# Altium project ESE516_ExampleLayoutProject_.PrjPcb (part 2 of 3)

## Sheet Rotary Encoder.SchDoc: ROTARY ENCODER
size 431 x 279 mm; Date: 02/07/2022; ApprovedBy: RTZ,HYW; CheckedBy: RTZ,HYW; Author: RTZ,HYW; CompanyName: Upenn; DrawnBy: RTZ,HYW; Engineer: RTZ,HYW; Organization: Upenn ESE; Address1: Electrical Engineering; Address2: 200 South 33rd St; Address3: Philadelphia; Address4: PA, 19104; SheetNumber: 6; SheetTotal: 11; ENG_APP_DATE: 02/15/22; DSN_APP_DATE: 02/15/22; CHK_APP_DATE: 02/15/22; DOC_NO_ASSY_DWG: TBD; DOC_NO_FAB_DWG: TBD; PCB_DWG_NO: TBD; Project: SimonSayGame; DESIGN_ITEM: 1.0; CAGE_CODE: TBD; DOC_NO_SCH_DWG: TBD; SCH_SCALE: NA; Time: 13:18
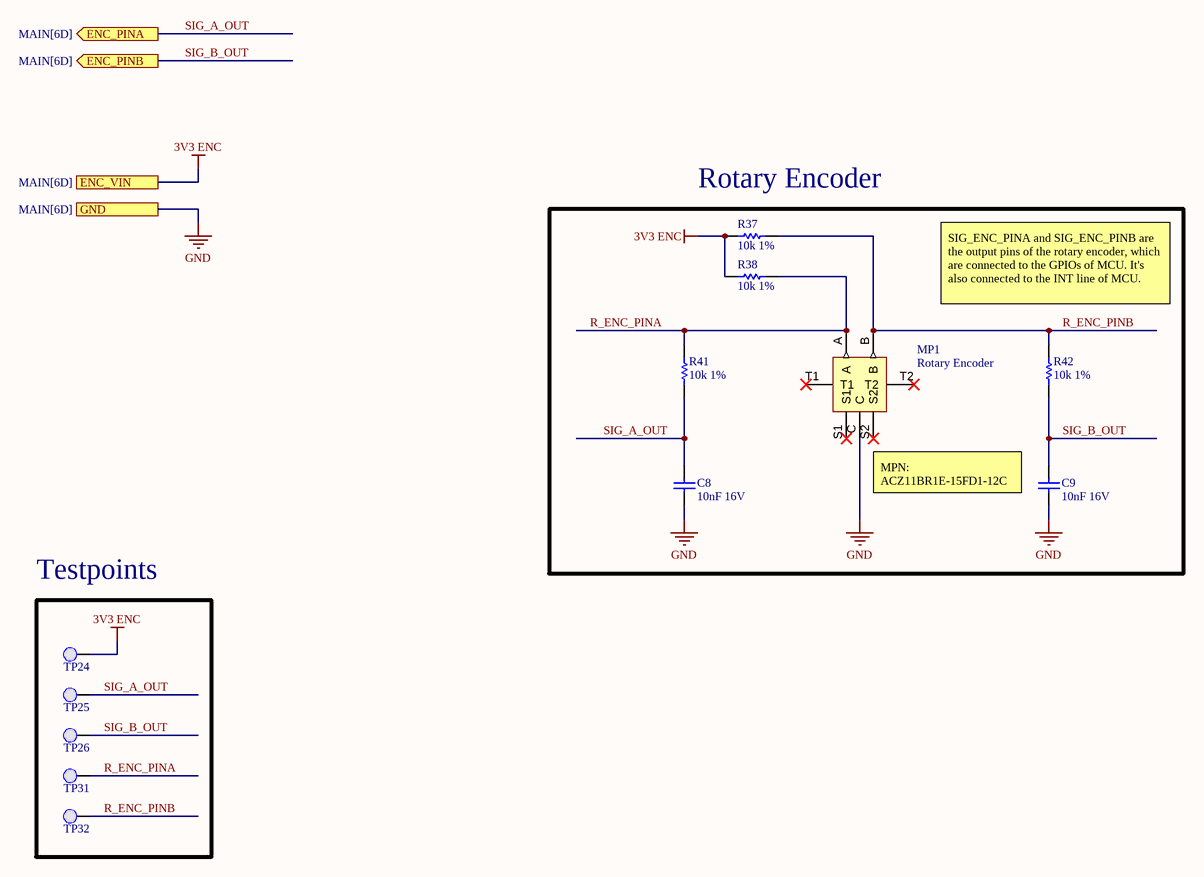
[diagram p5: Rotary Encoder.SchDoc]

### Parts
C8  10nF 16V  [CAPC1608X90]
C9  10nF 16V  [CAPC1608X90]
MP1  Rotary Encoder  [Rotary Encoder]
R37  10k 1%  [RESC1608X55X25ML10T15]
R38  10k 1%  [RESC1608X55X25ML10T15]
R41  10k 1%  [RESC1608X55X25ML10T15]
R42  10k 1%  [RESC1608X55X25ML10T15]
TP24  0.1" Pad  [PCBComponent]  (value not drawn)  (no BOM)
TP25  0.1" Pad  [PCBComponent]  (value not drawn)  (no BOM)
TP26  0.1" Pad  [PCBComponent]  (value not drawn)  (no BOM)
TP31  0.1" Pad  [PCBComponent]  (value not drawn)  (no BOM)
TP32  0.1" Pad  [PCBComponent]  (value not drawn)  (no BOM)

### Blocks framed on the sheet
Rotary Encoder: C8 C9 MP1 R37 R38 R41 R42
Testpoints: TP24-TP26 TP31 TP32

### Ports
ENC_PINA (out, see MAIN[6D]), ENC_PINB (out, see MAIN[6D]), ENC_VIN (see MAIN[6D]), GND (see MAIN[6D])

### Nets
3V3 ENC: R37.2 R38.2 TP24.1(PAD) ; port ENC_VIN
GND: C8.1 C9.1 MP1.C ; port GND
R_ENC_PINA: MP1.A R38.1 R41.2 TP31.1(PAD)  [project net R_ENC_PINA_6]
R_ENC_PINB: MP1.B R37.1 R42.2 TP32.1(PAD)  [project net R_ENC_PINB_6]
SIG_A_OUT: C8.2 R41.1 TP25.1(PAD) ; port ENC_PINA
SIG_B_OUT: C9.2 R42.1 TP26.1(PAD) ; port ENC_PINB

Not connected (* = marked no-connect by the designer): MP1 S1* S2* T1* T2*

### Notes on the sheet
- SIG_ENC_PINA and SIG_ENC_PINB are the output pins of the rotary encoder, which are connected to the GPIOs of MCU. It's also connected to the INT line of MCU.
  The SIG_A_OUT and SIG_B_OUT can be connected to the oscilloscope for test.
- MPN: ACZ11BR1E-15FD1-12C
- DWG. NO.
- REV.
- SHT.
- THIS DOCUMENT AND THE DATA DISCLOSED HEREIN OR HEREWITH IS THE PROPERTY OF ALTIUM LIMITED AND MAY BE FREELY DISTRIBUTED IN WHOLE. NO RIGHTS ARE RESERVED OR EXPRESS OR IMPLIED WARANTEE GIVEN.
- REVISION
- DESCRIPTION
- DATE
- APPROVED
- ENG:
- APPROVALS
- PROJECT
- DSN:
- CHK:
- REFERENCE DOCUMENTS
- PROJECT REVISION:
- TITLE
- DOCUMENT REVISION:
- DESIGN ITEM:
- BOM:
- FAB DWG:
- PCB DWG:
- ASSY DWG:
- SCALE:
- SIZE
- B
- CAGE CODE
- FILE NAME
- DWG NO.
- SHEET
- OF
- REV

### Library data of the parts
C8 C9 = C0603C103K4REC7867: Rotary Enc-Cap Cer 0603 10NF 16V X7R 10%; Manufacturer: KEMET; Supplier 1: Digi-Key; Supplier Part Number 1: 399-C0603C103K4REC7867CT-ND; Manufacturer Part Number: C0603C103K4REC7867; RoHS: No; Category: Ceramic Capacitors; Stock 1: 907; Pricing 1: 1=0.12000, 10=0.08800, 50=0.04820, 100=0.03930, 500=0.02810, 1000=0.02208 (USD)
MP1 = Rotary Encoder: MPN: ACZ11BR1E-15FD1-12C
R37 R38 R41 R42 = CMP-2000-04877-1: AF0603FR-0710KL; Manufacturer: Yageo; Part Number: AF0603FR-0710KL
TP24-TP26 TP31 TP32 = 0.1" Pad-A.4

## Sheet Joystick.SchDoc: JOYSTICK
size 431 x 279 mm; Date: 02/07/2022; ApprovedBy: RTZ,HYW; CheckedBy: RTZ,HYW; Author: RTZ,HYW; CompanyName: Upenn; DrawnBy: RTZ,HYW; Engineer: RTZ,HYW; Organization: Upenn ESE; Address1: Electrical Engineering; Address2: 200 South 33rd St; Address3: Philadelphia; Address4: PA, 19104; SheetNumber: 7; SheetTotal: 11; ENG_APP_DATE: 02/15/22; DSN_APP_DATE: 02/15/22; CHK_APP_DATE: 02/15/22; DOC_NO_ASSY_DWG: TBD; DOC_NO_FAB_DWG: TBD; PCB_DWG_NO: TBD; Project: SimonSayGame; DESIGN_ITEM: 1.0; CAGE_CODE: TBD; DOC_NO_SCH_DWG: TBD; SCH_SCALE: NA; Time: 13:18
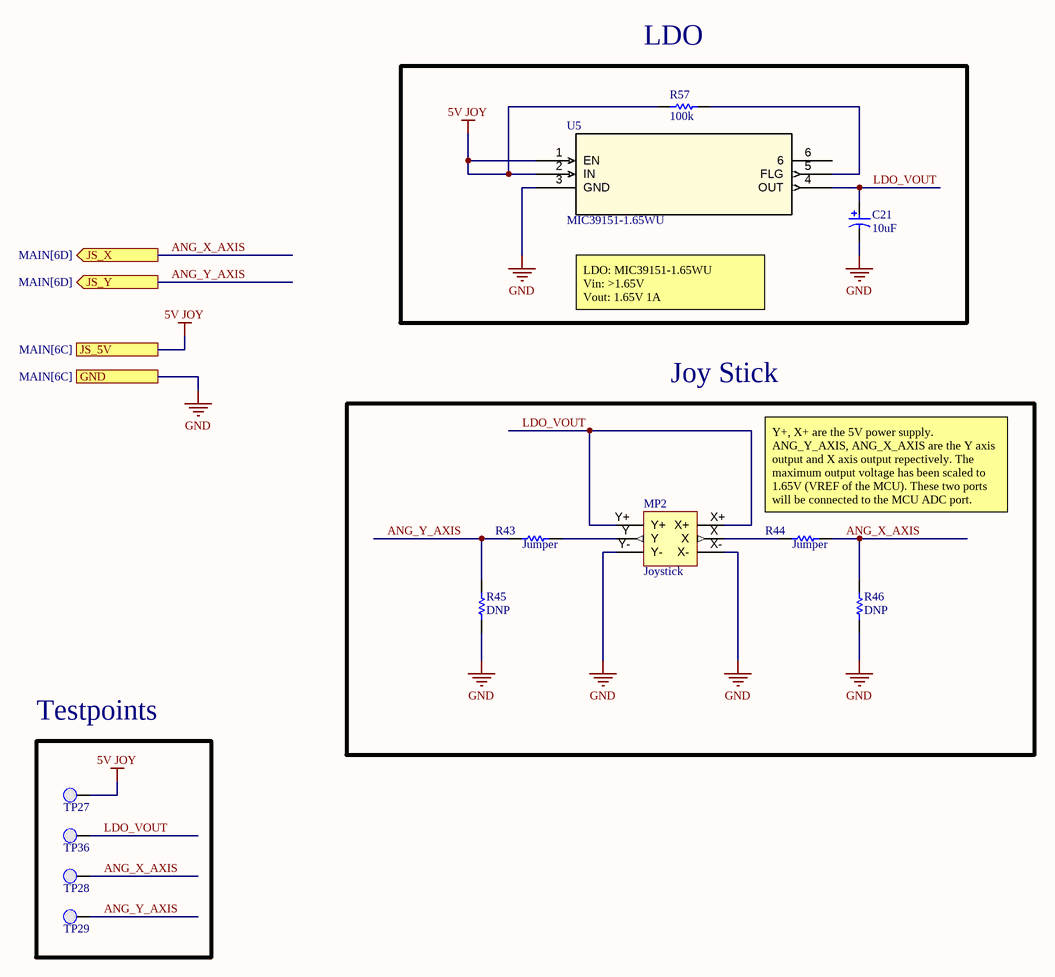
[diagram p6: Joystick.SchDoc]

### Parts
C21  10uF  [TMCHC1C106MTRF]
MP2  Joystick  [Joystick]
R43  Jumper  [RESC0603(1608)_N]
R44  Jumper  [RESC0603(1608)_N]
R45  DNP  [DNP]  (no BOM)
R46  DNP  [DNP]  (no BOM)
R57  100k  [RESC1609X55X30ML10T20]
TP27  0.1" Pad  [PCBComponent]  (value not drawn)  (no BOM)
TP28  0.1" Pad  [PCBComponent]  (value not drawn)  (no BOM)
TP29  0.1" Pad  [PCBComponent]  (value not drawn)  (no BOM)
TP36  0.1" Pad  [PCBComponent]  (value not drawn)  (no BOM)
U5  MIC39151-1.65WU  [TO-263-5_MCL]

### Blocks framed on the sheet
LDO: C21 R57 U5
Joy Stick: MP2 R43-R46
Testpoints: TP27-TP29 TP36

### Ports
GND (see MAIN[6C]), JS_5V (see MAIN[6C]), JS_X (out, see MAIN[6D]), JS_Y (out, see MAIN[6D])

### Nets
5V JOY: R57.1 TP27.1(PAD) U5.1(EN) U5.2(IN) ; port JS_5V  [project net 5V]
GND: C21.2 MP2.X- MP2.Y- R45.1 R46.1 U5.3(GND) ; port GND
ANG_X_AXIS: R44.2 R46.2 TP28.1(PAD) ; port JS_X  [project net ADC_X]
ANG_Y_AXIS: R43.1 R45.2 TP29.1(PAD) ; port JS_Y  [project net ADC_Y]
LDO_VOUT: C21.1 MP2.X+ MP2.Y+ TP36.1(PAD) U5.4(OUT)  [project net LDO_VOUT_7]
NetMP2_X: MP2.X R44.1
NetMP2_Y: MP2.Y R43.2
NetR57_2: R57.2 U5.5(FLG)

Not connected (* = marked no-connect by the designer): U5 6

### Notes on the sheet
- LDO: MIC39151-1.65WU
  Vin: >1.65V
  Vout: 1.65V 1A
- (near R44) Y+, X+ are the 5V power supply.
  ANG_Y_AXIS, ANG_X_AXIS are the Y axis output and X axis output repectively. The maximum output voltage has been scaled to 1.65V (VREF of the MCU). These two ports will be connected to the MCU ADC port.
  Y-, X- are the GND.
- DWG. NO.
- REV.
- SHT.
- THIS DOCUMENT AND THE DATA DISCLOSED HEREIN OR HEREWITH IS THE PROPERTY OF ALTIUM LIMITED AND MAY BE FREELY DISTRIBUTED IN WHOLE. NO RIGHTS ARE RESERVED OR EXPRESS OR IMPLIED WARANTEE GIVEN.
- REVISION
- DESCRIPTION
- DATE
- APPROVED
- ENG:
- APPROVALS
- PROJECT
- DSN:
- CHK:
- REFERENCE DOCUMENTS
- PROJECT REVISION:
- TITLE
- DOCUMENT REVISION:
- DESIGN ITEM:
- BOM:
- FAB DWG:
- PCB DWG:
- ASSY DWG:
- SCALE:
- SIZE
- B
- CAGE CODE
- FILE NAME
- DWG NO.
- SHEET
- OF
- REV

### Library data of the parts
C21 = TMCHC1C106MTRF: 10uF TMCHC1C106MTRF LDO capacitor; Manufacturer Part Number: TMCHC1C106MTRF; Category: Tantalum Capacitors; RoHS Compliant: Yes
R43 R44 = CMP-1012-00001-1: Jumper 0603 (1608 Metric); Case-Metric: 1608; Value: 0.00 Ohm; Power: None; Case-EIA: 0603; Technology: SMT; Tolerance: None
R45 R46 = DNP: Temperature Coefficient: 100ppm/°C; Power Rating: 63mW; Voltage Rating: 50V; Resistance Tolerance: 1%; RoHS: Yes; Case/Package: 0402; Number of Pins: 2; Contact Plating: Tin; Case Code (Metric): 1005; Case Code (Imperial): 0402; Min Operating Temperature: -55°C; Max Operating Temperature: 155°C; Resistor Type: Thick Film; Package Quantity: 10; Number of Terminations: 2; Termination: SMD/SMT; Max Power Dissipation: 63mW; Features: Automotive AEC-Q200; Series: CRCW; Voltage Rating (DC): 50V; Construction: Rectangular; Technology: THICK FILM; Length: 1mm; Width: 0.02inch; Height: 0.35mm; Depth: 0.5mm; Radiation Hardening: No; RoHS Compliant: Yes; Lead Free: Lead Free; REACH SVHC: Unknown; Military Standard: Not
R57 = CMP-2000-03685-1: Manufacturer: Vishay Dale; Part Number: TNPW0603100KBEEA
TP27-TP29 TP36 = 0.1" Pad-A.4
U5 = MIC39151-1.65WU: No Description Available; Mfr_Name: Micrel; Copyright: Copyright (C) 2022 Ultra Librarian. All rights reserved.; Manufacturer_Part_Number: MIC39151-1.65WU; Digi-Key_Part_Number_1: MIC39151-1.65WU-ND; RefDes: RefDes; Type: DEV

## Sheet Boost converter.SchDoc: BOOST CONVERTER
size 431 x 279 mm; Date: 02/07/2022; ApprovedBy: RTZ,HYW; CheckedBy: RTZ,HYW; Author: RTZ,HYW; CompanyName: Upenn; DrawnBy: RTZ,HYW; Engineer: RTZ,HYW; Organization: Upenn ESE; Address1: Electrical Engineering; Address2: 200 South 33rd St; Address3: Philadelphia; Address4: PA, 19104; SheetNumber: 8; SheetTotal: 11; ENG_APP_DATE: 02/15/22; DSN_APP_DATE: 02/15/22; CHK_APP_DATE: 02/15/22; DOC_NO_ASSY_DWG: TBD; DOC_NO_FAB_DWG: TBD; PCB_DWG_NO: TBD; Project: SimonSayGame; DESIGN_ITEM: 1.0; CAGE_CODE: TBD; DOC_NO_SCH_DWG: TBD; SCH_SCALE: NA; Time: 13:18
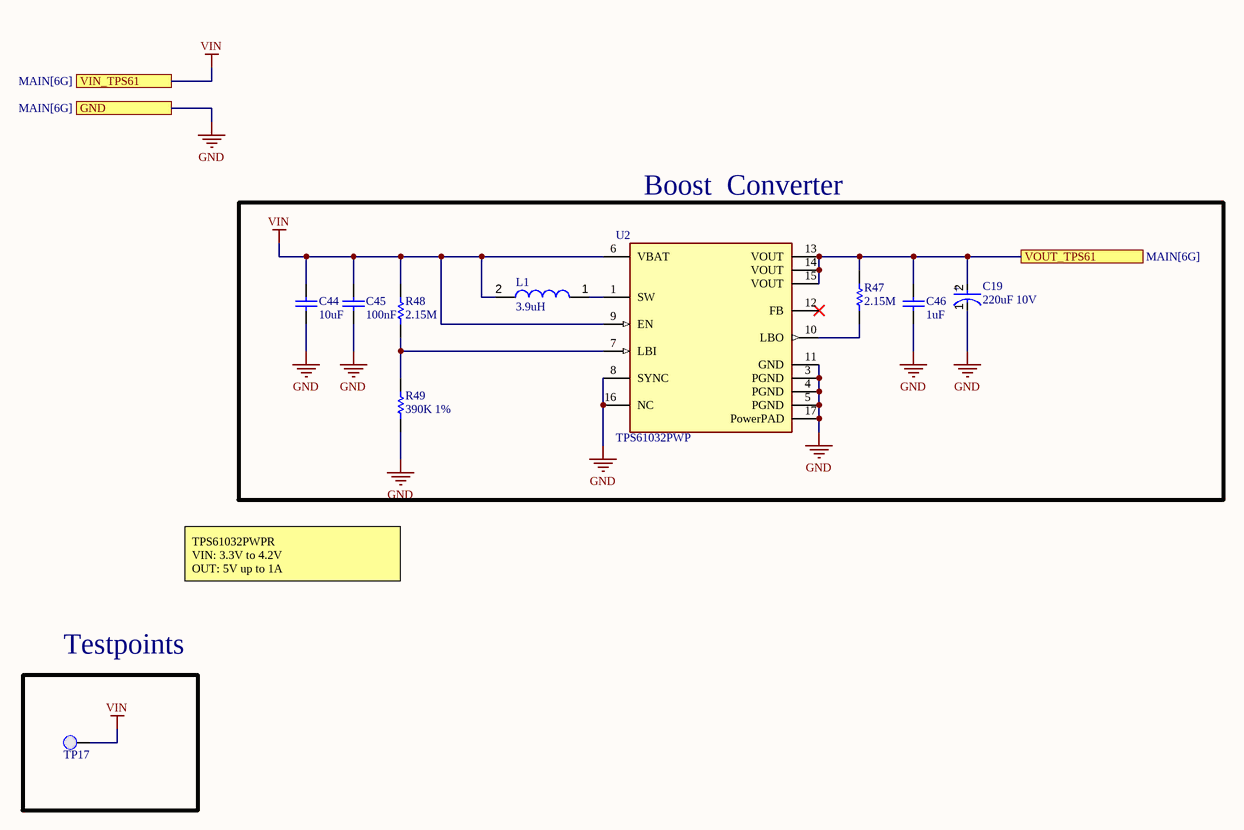
[diagram p7: Boost converter.SchDoc]

### Parts
C19  220uF 10V  [FP-T495D227K010ATE100-MFG]
C44  10uF  [CAPC2012X127N]
C45  100nF  [CAPC1005X55X25LL05T10]
C46  1uF  [CAPC1608X90]
L1  3.9uH  [7843330390]
R47  2.15M  [RESC1005X40X25ML05T05]
R48  2.15M  [RESC1005X40X25ML05T05]
R49  390K 1%  [RESC0603(1608)_M]
TP17  0.1" Pad  [PCBComponent]  (value not drawn)  (no BOM)
U2  TPS61032PWP  [FP-PWP0016C-MFG]

### Blocks framed on the sheet
Boost  Converter: C19 C44-C46 L1 R47-R49 U2
Testpoints: TP17

### Ports
GND (see MAIN[6G]), VIN_TPS61 (see MAIN[6G]), VOUT_TPS61 (see MAIN[6G])

### Nets
GND: C19.1(C) C44.1 C45.1 C46.1 R49.1 U2.3(PGND) U2.4(PGND) U2.5(PGND) U2.8(SYNC) U2.11(GND) U2.16(NC) U2.17(PowerPAD) ; port GND
VIN: C44.2 C45.2 L1.2 R48.2 TP17.1(PAD) U2.6(VBAT) U2.9(EN) ; port VIN_TPS61  [project net VOUT]
VOUT_TPS61: C19.2(A) C46.2 R47.2 U2.13(VOUT) U2.14(VOUT) U2.15(VOUT) ; port VOUT_TPS61
NetL1_1: L1.1 U2.1(SW)
NetR47_1: R47.1 U2.10(LBO)
NetR48_1: R48.1 R49.2 U2.7(LBI)

Not connected (* = marked no-connect by the designer): U2 12(FB)*

### Notes on the sheet
- TPS61032PWPR
  VIN: 3.3V to 4.2V
  OUT: 5V up to 1A
- DWG. NO.
- REV.
- SHT.
- THIS DOCUMENT AND THE DATA DISCLOSED HEREIN OR HEREWITH IS THE PROPERTY OF ALTIUM LIMITED AND MAY BE FREELY DISTRIBUTED IN WHOLE. NO RIGHTS ARE RESERVED OR EXPRESS OR IMPLIED WARANTEE GIVEN.
- REVISION
- DESCRIPTION
- DATE
- APPROVED
- ENG:
- APPROVALS
- PROJECT
- DSN:
- CHK:
- REFERENCE DOCUMENTS
- PROJECT REVISION:
- TITLE
- DOCUMENT REVISION:
- DESIGN ITEM:
- BOM:
- FAB DWG:
- PCB DWG:
- ASSY DWG:
- SCALE:
- SIZE
- B
- CAGE CODE
- FILE NAME
- DWG NO.
- SHEET
- OF
- REV
- (in symbol CMP-03017-000025-1) +

### Library data of the parts
C19 = CMP-03017-000025-1: CAP TANT 220UF 10% 10V 2917, T495D227K010ATE100; Life (Hours): 2000Hour; Dielectric Material: Tantalum; Ripple Current: 1.225A; Dissipation Factor: 8%; ESR (Equivalent Series Resistance): 100mR; Leakage Current: 22uA; Polarity: Polar; Max Operating Temperature: 125°C; Features: General Purpose; Voltage Rating: 10V; Depth: 4.3mm; Case Code (Imperial): 2917; Length: 7.3mm; Package Quantity: 1; Mount: Surface Mount; Min Operating Temperature: -55°C; Termination: SMD/SMT; Voltage Rating (DC): 10V; Height: 2.8mm; Construction: Flat; Case Code (Metric): 7343; Radiation Hardening: No; Number of Pins: 2; Series: T495; Tolerance: 10%; Capacitance: 220uF; Case/Package: 2917; Lead Pitch: 3.8mm; RoHS Compliant: Yes; Width: 0.169inch; Packaging: Tape and Reel; Voltage: 10V; Height - Seated (Max): 0.122inch; REACH SVHC: No SVHC
C44 = CMP-06035-062410-1: Boost Cin, Buck Cin-Cap Ceramic 10uF 16V X7R 20% SMD 0805 125°C Blister T/R; Manufacturer: Murata; Manufacturer Part Number: GRJ155R60J106ME11D; Voltage Rating: 6.3V; Length: 0.039inch; Width: 0.02inch; Capacitance: 10uF; Max Operating Temperature: 85°C; Features: Soft Termination; Case Code (Metric): 1005; Tolerance: 20%; Min Operating Temperature: -55°C; Thickness: 0.028inch; Mount: Surface Mount; Packaging: Cut Tape; Case/Package: 0402; Case Code (Imperial): 0402; RoHS Compliant: Yes; Supplier 1: Digi-Key; Supplier Part Number 1: 490-13211-2-ND; RoHS: Yes; Category: Ceramic Capacitors; Stock 1: 1752680; Pricing 1: 10000=0.03490, 20000=0.03307 (USD); ComponentLink1URL: http://psearch.en.murata.com/capacitor/product/GRJ155R60J106ME11%23.pdf?src-supplier=Digi-Key; ComponentLink1Description: http://psearch.en.murata.com/capacitor/product/GRJ155R60J106ME11%23.pdf?src-supplier=Digi-Key; Supplier 2: Digi-Key; Supplier Part Number 2: 311-1338-2-ND; Stock 2: 27298742; Pricing 2: 10000=0.00554, 20000=0.00528 (USD); Number of Pins: 2; Dielectric: X7R; Voltage Rating (DC): 16V; Package Quantity: 1; Termination: SMD/SMT; Resistor Type: Ceramic; Voltage: 16V; Series: CC; Height: 0.5mm; Depth: 0.5mm; Radiation Hardening: No; REACH SVHC: No SVHC; Lead Free: Lead Free; Halogen Free: Halogen Free; ComponentLink2URL: https://datasheet.ciiva.com/11788/0900766b80ce67ed-11788364.pdf?src-supplier=RSComponents; ComponentLink2Description: https://datasheet.ciiva.com/11788/0900766b80ce67ed-11788364.pdf?src-supplier=RSComponents; ComponentLink3URL: https://datasheet.ciiva.com/7978/1489800-7978111.pdf?src-supplier=Element14; ComponentLink3Description: https://datasheet.ciiva.com/7978/1489800-7978111.pdf?src-supplier=Element14; ComponentLink4URL: https://datasheet.ciiva.com/28450/1489800-28450335.pdf?src-supplier=Element14; ComponentLink4Description: https://datasheet.ciiva.com/28450/1489800-28450335.pdf?src-supplier=Element14; ComponentLink5URL: https://datasheet.ciiva.com/161/mlccorderingcode-161545.pdf?src-supplier=Digi-Key; ComponentLink5Description: https://datasheet.ciiva.com/161/mlccorderingcode-161545.pdf?src-supplier=Digi-Key; ComponentLink6URL: https://datasheet.ciiva.com/161/mlccorderingcode-161544.pdf?src-supplier=Digi-Key; ComponentLink6Description: https://datasheet.ciiva.com/161/mlccorderingcode-161544.pdf?src-supplier=Digi-Key; ComponentLink7URL: https://datasheet.ciiva.com/161/mlccorderingcode-161546.pdf?src-supplier=Digi-Key; ComponentLink7Description: https://datasheet.ciiva.com/161/mlccorderingcode-161546.pdf?src-supplier=Digi-Key; ComponentLink8URL: https://datasheet.ciiva.com/13395/upy-gphc-x7r-6-3v-to-50v-8-13395676.pdf?src-supplier=Mouser; ComponentLink8Description: https://datasheet.ciiva.com/13395/upy-gphc-x7r-6-3v-to-50v-8-13395676.pdf?src-supplier=Mouser; ComponentLink9URL: https://datasheet.ciiva.com/11587/upy-gphc-x7r-6-3v-to-50v-8-11587305.pdf?src-supplier=Avnet; ComponentLink9Description: https://datasheet.ciiva.com/11587/upy-gphc-x7r-6-3v-to-50v-8-11587305.pdf?src-supplier=Avnet; ComponentLink10URL: https://datasheet.ciiva.com/8033/1734573-8033663.pdf?src-supplier=Element14; ComponentLink10Description: https://datasheet.ciiva.com/8033/1734573-8033663.pdf?src-supplier=Element14; ComponentLink11URL: https://datasheet.ciiva.com/8033/1734573-8033661.pdf?src-supplier=Element14; ComponentLink11Description: https://datasheet.ciiva.com/8033/1734573-8033661.pdf?src-supplier=Element14; ComponentLink12URL: https://datasheet.ciiva.com/16625/upy-gphc-x7r-6-3v-to-50v-8-16625511.pdf?src-supplier=Avnet+Europe; ComponentLink12Description: https://datasheet.ciiva.com/16625/upy-gphc-x7r-6-3v-to-50v-8-16625511.pdf?src-supplier=Avnet+Europe; Supplier 3: Digi-Key; Supplier Part Number 3: 311-3508-1-ND; Stock 3: 2481; Pricing 3: 1=0.64000, 10=0.45400, 50=0.34360, 100=0.29920, 500=0.22164, 1000=0.18840 (USD); ComponentLink13URL: http://www.yageo.com/documents/recent/UPY-GPHC_X7R_6.3V-to-50V_18.pdf?src-supplier=Digi-Key; ComponentLink13Description: http://www.yageo.com/documents/recent/UPY-GPHC_X7R_6.3V-to-50V_18.pdf?src-supplier=Digi-Key; ComponentLink14URL: https://datasheet.octopart.com/CC0805MKX7R7BB106-Yageo-datasheet-10883670.pdf; ComponentLink14Description: https://datasheet.octopart.com/CC0805MKX7R7BB106-Yageo-datasheet-10883670.pdf; ComponentLink15URL: https://datasheet.octopart.com/Surface-Mount-Ceramic-Multilayer-Capacitors%3B-General-Purpose-%26-High-Capacitance-Class-2%2C-X7R-Yageo-datasheet-family-114.pdf; ComponentLink15Description: https://datasheet.octopart.com/Surface-Mount-Ceramic-Multilayer-Capacitors%3B-General-Purpose-%26-High-Capacitance-Class-2%2C-X7R-Yageo-datasheet-family-114.pdf; ComponentLink16URL: https://datasheet.octopart.com/CC0805MKX7R7BB106-Yageo-datasheet-147453679.pdf?src-supplier=Future+Electronics; ComponentLink16Description: https://datasheet.octopart.com/CC0805MKX7R7BB106-Yageo-datasheet-147453679.pdf?src-supplier=Future+Electronics
C45 = CMP-2000-06331-1: Boost Cinx, Cap 100NF 16V 0402 SMD 10% X7R; Manufacturer: Murata; Manufacturer Part Number: GRM155R71A104KA01D; Rated Voltage: 10V; Capacitance: 100000pF; Dissipation Factor: 0.035%; Manufacturer URL: http://www.murata.com/; Datasheet Version: 02/2016; Datasheet URL: http://search.murata.co.jp/Ceramy/image/img/A01X/G101/ENG/GRM155R71A104KA01-01.pdf; Dielectric: X7R; Package Reference: 0402; Tolerance (%): ±10%; Package Description: 2-Pin Surface Mount Device, Body 1 x 0.5 mm; Mounting Technology: SurfaceMount; Case Size/Dimension: 0402; Supplier 1: Digi-Key; Supplier Part Number 1: 490-6321-1-ND; RoHS: Yes; Category: Ceramic Capacitors; Stock 1: 5059; Pricing 1: 1=0.10000, 10=0.02300, 50=0.01260, 100=0.01030, 500=0.00736, 1000=0.00578, 2500=0.00525, 5000=0.00483 (USD); Mount: Surface Mount; Case/Package: 0402; Number of Pins: 2; Case Code (Metric): 1005; Case Code (Imperial): 0402; Min Operating Temperature: -55°C; Max Operating Temperature: 125°C; Tolerance: 10%; Package Quantity: 1; Voltage Rating: 10V; Packaging: Tape and Reel; Voltage Rating (DC): 10V; Termination: SMD/SMT; Voltage: 10V; Series: GRM; Construction: Flat; Length: 1mm; Width: 0.02inch; Height: 0.5mm; Thickness: 0.022inch; Depth: 0.5mm; Size: 0.5mm; Radiation Hardening: No; REACH SVHC: No SVHC; Lead Free: Lead Free; RoHS Compliant: Yes; ComponentLink1URL: https://datasheet.ciiva.com/6271/product-6271137.pdf?src-supplier=Digi-Key; ComponentLink1Description: https://datasheet.ciiva.com/6271/product-6271137.pdf?src-supplier=Digi-Key; ComponentLink2URL: https://datasheet.ciiva.com/19475/1856345-19475961.pdf?src-supplier=Jameco; ComponentLink2Description: https://datasheet.ciiva.com/19475/1856345-19475961.pdf?src-supplier=Jameco; ComponentLink3URL: https://datasheet.ciiva.com/11789/0900766b80ef921d-11789061.pdf?src-supplier=RSComponents; ComponentLink3Description: https://datasheet.ciiva.com/11789/0900766b80ef921d-11789061.pdf?src-supplier=RSComponents; ComponentLink4URL: https://datasheet.ciiva.com/7937/1747441-7937613.pdf?src-supplier=Element14; ComponentLink4Description: https://datasheet.ciiva.com/7937/1747441-7937613.pdf?src-supplier=Element14; ComponentLink5URL: https://datasheet.ciiva.com/18184/getdatasheetpartid-130330-18184636.pdf?src-supplier=Verical; ComponentLink5Description: https://datasheet.ciiva.com/18184/getdatasheetpartid-130330-18184636.pdf?src-supplier=Verical; ComponentLink6URL: https://datasheet.ciiva.com/6271/partnumbering-e-01-6271135.pdf?src-supplier=Digi-Key; ComponentLink6Description: https://datasheet.ciiva.com/6271/partnumbering-e-01-6271135.pdf?src-supplier=Digi-Key; ComponentLink7URL: https://datasheet.ciiva.com/16199/c02e-16199258.pdf?src-supplier=Future+Electronics; ComponentLink7Description: https://datasheet.ciiva.com/16199/c02e-16199258.pdf?src-supplier=Future+Electronics; Supplier 2: Digi-Key; Supplier Part Number 2: 311-1338-2-ND; Stock 2: 27298742; Pricing 2: 10000=0.00554, 20000=0.00528 (USD); Resistor Type: Ceramic; Halogen Free: Halogen Free; ComponentLink8URL: https://datasheet.ciiva.com/11788/0900766b80ce67ed-11788364.pdf?src-supplier=RSComponents; ComponentLink8Description: https://datasheet.ciiva.com/11788/0900766b80ce67ed-11788364.pdf?src-supplier=RSComponents; ComponentLink9URL: https://datasheet.ciiva.com/7978/1489800-7978111.pdf?src-supplier=Element14; ComponentLink9Description: https://datasheet.ciiva.com/7978/1489800-7978111.pdf?src-supplier=Element14; ComponentLink10URL: https://datasheet.ciiva.com/28450/1489800-28450335.pdf?src-supplier=Element14; ComponentLink10Description: https://datasheet.ciiva.com/28450/1489800-28450335.pdf?src-supplier=Element14; ComponentLink11URL: https://datasheet.ciiva.com/161/mlccorderingcode-161545.pdf?src-supplier=Digi-Key; ComponentLink11Description: https://datasheet.ciiva.com/161/mlccorderingcode-161545.pdf?src-supplier=Digi-Key; ComponentLink12URL: https://datasheet.ciiva.com/161/mlccorderingcode-161544.pdf?src-supplier=Digi-Key; ComponentLink12Description: https://datasheet.ciiva.com/161/mlccorderingcode-161544.pdf?src-supplier=Digi-Key; ComponentLink13URL: https://datasheet.ciiva.com/161/mlccorderingcode-161546.pdf?src-supplier=Digi-Key; ComponentLink13Description: https://datasheet.ciiva.com/161/mlccorderingcode-161546.pdf?src-supplier=Digi-Key; ComponentLink14URL: https://datasheet.ciiva.com/13395/upy-gphc-x7r-6-3v-to-50v-8-13395676.pdf?src-supplier=Mouser; ComponentLink14Description: https://datasheet.ciiva.com/13395/upy-gphc-x7r-6-3v-to-50v-8-13395676.pdf?src-supplier=Mouser; ComponentLink15URL: https://datasheet.ciiva.com/11587/upy-gphc-x7r-6-3v-to-50v-8-11587305.pdf?src-supplier=Avnet; ComponentLink15Description: https://datasheet.ciiva.com/11587/upy-gphc-x7r-6-3v-to-50v-8-11587305.pdf?src-supplier=Avnet; ComponentLink16URL: https://datasheet.ciiva.com/8033/1734573-8033663.pdf?src-supplier=Element14; ComponentLink16Description: https://datasheet.ciiva.com/8033/1734573-8033663.pdf?src-supplier=Element14; ComponentLink17URL: https://datasheet.ciiva.com/8033/1734573-8033661.pdf?src-supplier=Element14; ComponentLink17Description: https://datasheet.ciiva.com/8033/1734573-8033661.pdf?src-supplier=Element14; ComponentLink18URL: https://datasheet.ciiva.com/16625/upy-gphc-x7r-6-3v-to-50v-8-16625511.pdf?src-supplier=Avnet+Europe; ComponentLink18Description: https://datasheet.ciiva.com/16625/upy-gphc-x7r-6-3v-to-50v-8-16625511.pdf?src-supplier=Avnet+Europe
C46 = C0603C105K8PACTU: Boost Coutx, Cap Ceramic 1uF 16V X7R 5% SMD 0603 125°C Paper T/R; Manufacturer: KEMET; MF: {'manufacturer': u'KEMET'}; Tolerance: 10%; Dielectric: X5R; Voltage: 10V; Value: *; Package: None; MP: C0603C105K8PACTU; Price: None; Availability: Unavailable; Supplier 1: Digi-Key; Supplier Part Number 1: 399-C0603C105K8PAC7867TR-ND; Manufacturer Part Number: C0603C105K8PACTU; RoHS: Yes; Category: Ceramic Capacitors; Stock 1: 359436; Pricing 1: 4000=0.01113, 8000=0.01016 (USD); Mount: Surface Mount; Case/Package: 0603; Number of Pins: 2; Dielectric Material: Ceramic; Case Code (Imperial): 0603; Case Code (Metric): 1608; Weight: 7.1E-05oz; Min Operating Temperature: -55°C; Max Operating Temperature: 85°C; Capacitance: 1uF; Packaging: Tape and Reel; Termination: SMD/SMT; Voltage Rating (DC): 10V; Package Quantity: 1; Voltage Rating: 10V; Series: C; Construction: Flat; Length: 1.6mm; Width: 0.031inch; Height: 0.8mm; Depth: 0.8mm; Thickness: 0.035inch; Radiation Hardening: No; Lead Free: Lead Free; REACH SVHC: No SVHC; RoHS Compliant: Yes; ComponentLink1URL: https://datasheet.ciiva.com/11787/0900766b8116eb59-11787747.pdf?src-supplier=RSComponents; ComponentLink1Description: https://datasheet.ciiva.com/11787/0900766b8116eb59-11787747.pdf?src-supplier=RSComponents; ComponentLink2URL: https://datasheet.ciiva.com/6074/40889-6074647.pdf?src-supplier=Farnell; ComponentLink2Description: https://datasheet.ciiva.com/6074/40889-6074647.pdf?src-supplier=Farnell; ComponentLink3URL: https://datasheet.ciiva.com/26847/getdatasheetpartid-385480-26847548.pdf?src-supplier=Verical; ComponentLink3Description: https://datasheet.ciiva.com/26847/getdatasheetpartid-385480-26847548.pdf?src-supplier=Verical; ComponentLink4URL: https://datasheet.ciiva.com/7823/40889-7823998.pdf?src-supplier=Element14; ComponentLink4Description: https://datasheet.ciiva.com/7823/40889-7823998.pdf?src-supplier=Element14; ComponentLink5URL: https://datasheet.ciiva.com/7823/1929483-7823999.pdf?src-supplier=Element14; ComponentLink5Description: https://datasheet.ciiva.com/7823/1929483-7823999.pdf?src-supplier=Element14; ComponentLink6URL: https://datasheet.ciiva.com/28645/1831760-28645655.pdf?src-supplier=Element14; ComponentLink6Description: https://datasheet.ciiva.com/28645/1831760-28645655.pdf?src-supplier=Element14; Supplier 2: Digi-Key; Supplier Part Number 2: 13-CC0603JRX7R7BB102CT-ND; Stock 2: 33465; Pricing 2: 1=0.10000, 10=0.07000, 50=0.03800, 100=0.03100, 500=0.02218, 1000=0.01742 (USD); Halogen Free: Halogen Free; ComponentLink7URL: https://datasheet.ciiva.com/11494/upy-gphc-x7r-6-3v-to-50v-8-11494730.pdf?src-supplier=Avnet; ComponentLink7Description: https://datasheet.ciiva.com/11494/upy-gphc-x7r-6-3v-to-50v-8-11494730.pdf?src-supplier=Avnet; Supplier 3: Digi-Key; Supplier Part Number 3: 311-3485-1-ND; Stock 3: 56081; Pricing 3: 1=0.26000, 10=0.17800, 50=0.10680, 100=0.09020, 500=0.06174, 1000=0.05462 (USD); ComponentLink8URL: http://www.yageo.com/documents/recent/UPY-GPHC_X7R_6.3V-to-50V_18.pdf?src-supplier=Digi-Key; ComponentLink8Description: http://www.yageo.com/documents/recent/UPY-GPHC_X7R_6.3V-to-50V_18.pdf?src-supplier=Digi-Key
L1 = 7843330390: Boost L1-Inductor, Aec-Q200, 3.9Uh, Shld, 11.2A Rohs Compliant: Yes; Manufacturer: Wurth Electronics; Supplier 1: Digi-Key; Supplier Part Number 1: 732-11759-1-ND; Manufacturer Part Number: 7843330390; RoHS: Yes; Stock 1: 334; Pricing 1: 1=2.77000, 10=2.71300, 50=2.50400, 100=2.39900 (USD); RoHS Compliant: No
R47 R48 = CMP-2002-00322-1: Boost Rlbt-Res Thick Film 0402 2.15M Ohm 1% 1/16W ±100ppm/°C Molded SMD SMD Paper T/R; Manufacturer: Vishay Dale; Part Number: CRCW04022M15FKED; Resistance: 2.15MR; Max Power Dissipation: 63mW; Voltage Rating: 50V; Supplier 1: Digi-Key; Supplier Part Number 1: 541-2.15MLCT-ND; Manufacturer Part Number: CRCW04022M15FKED; RoHS: Yes; Category: Chip SMD Resistors; Stock 1: 790; Pricing 1: 1=0.10000, 10=0.03800, 100=0.01530, 1000=0.00686, 2500=0.00595, 5000=0.00492 (USD); Case/Package: 0402; Number of Pins: 2; Weight: 2.3E-05oz; Case Code (Metric): 1005; Case Code (Imperial): 0402; Contact Plating: Tin; Min Operating Temperature: -55°C; Max Operating Temperature: 155°C; Packaging: Tape and Reel; Tolerance: 1%; Resistor Type: Thick Film; Number of Terminations: 2; Temperature Coefficient: 100ppm/°C; Power Rating: 63mW; Package Quantity: 10000; Termination: SMD/SMT; Voltage Rating (DC): 50V; Features: Automotive AEC-Q200; Series: CRCW; Construction: Rectangular; Resistance Tolerance: 1%; Length: 1mm; Width: 0.02inch; Height: 0.016inch; Depth: 0.5mm; Radiation Hardening: No; RoHS Compliant: Yes; REACH SVHC: Unknown; Military Standard: Not; Lead Free: Lead Free; ComponentLink1URL: https://datasheet.ciiva.com/9091/dcrcwe3-9091823.pdf?src-supplier=Avnet; ComponentLink1Description: https://datasheet.ciiva.com/9091/dcrcwe3-9091823.pdf?src-supplier=Avnet; ComponentLink2URL: https://datasheet.ciiva.com/2464/dcrcwe3-2464648.pdf?src-supplier=Digi-Key; ComponentLink2Description: https://datasheet.ciiva.com/2464/dcrcwe3-2464648.pdf?src-supplier=Digi-Key; ComponentLink3URL: https://datasheet.ciiva.com/2464/dcrcwe3-2464649.pdf?src-supplier=Digi-Key; ComponentLink3Description: https://datasheet.ciiva.com/2464/dcrcwe3-2464649.pdf?src-supplier=Digi-Key; ComponentLink4URL: https://datasheet.ciiva.com/2464/dcrcwe3-2464650.pdf?src-supplier=Digi-Key; ComponentLink4Description: https://datasheet.ciiva.com/2464/dcrcwe3-2464650.pdf?src-supplier=Digi-Key; ComponentLink5URL: https://datasheet.ciiva.com/5543/dcrcwe3-109170-5543499.pdf?src-supplier=Mouser; ComponentLink5Description: https://datasheet.ciiva.com/5543/dcrcwe3-109170-5543499.pdf?src-supplier=Mouser; ComponentLink6URL: https://datasheet.ciiva.com/22708/1697337-22708317.pdf?src-supplier=Element14; ComponentLink6Description: https://datasheet.ciiva.com/22708/1697337-22708317.pdf?src-supplier=Element14; ComponentLink7URL: https://datasheet.ciiva.com/7801/1697337-7801003.pdf?src-supplier=Element14; ComponentLink7Description: https://datasheet.ciiva.com/7801/1697337-7801003.pdf?src-supplier=Element14; ComponentLink8URL: https://datasheet.ciiva.com/7801/1697337-7801004.pdf?src-supplier=Element14; ComponentLink8Description: https://datasheet.ciiva.com/7801/1697337-7801004.pdf?src-supplier=Element14
R49 = CMP-1012-00802-1: Boost Rlbb-Res Thick Film 0603 390K Ohm 1% 0.1W(1/10W) ±100ppm/C Pad SMD T/R; Manufacturer: Yageo; Manufacturer Part Number: RC0603FR-07390KL; Case-EIA: 0603; Case-Metric: 1608; Value: 390000.00 Ohm; Resistance: 390kR; Power Rating: 100mW; Voltage Rating: 50V; Temperature Coefficient: 100ppm/°C; Working Voltage: 75V; Power: 0.1 W; Technology: SMT; Tolerance: 1 %; Supplier 1: Digi-Key; Supplier Part Number 1: 311-390KHRCT-ND; RoHS: Yes; Category: Chip SMD Resistors; Stock 1: 129633; Pricing 1: 1=0.10000, 10=0.02400, 100=0.00970, 1000=0.00436, 2500=0.00378 (USD); Case/Package: 0603; Number of Pins: 2; Case Code (Imperial): 0603; Case Code (Metric): 1608; Min Operating Temperature: -55°C; Max Operating Temperature: 155°C; Packaging: Tape and Reel; Voltage Rating (DC): 50V; Package Quantity: 1; Termination: SMD/SMT; Resistor Type: Thick Film; Number of Terminations: 2; Max Power Dissipation: 100mW; Features: Moisture Resistant; Series: RC; Resistance Tolerance: 1%; Construction: Rectangular; Length: 1.6mm; Width: 0.031inch; Height: 0.022inch; Depth: 0.8mm; REACH SVHC: Unknown; Military Standard: Not; Lead Free: Lead Free; RoHS Compliant: Yes; ComponentLink1URL: https://datasheet.ciiva.com/5557/rc0603-5557952.pdf?src-supplier=Mouser; ComponentLink1Description: https://datasheet.ciiva.com/5557/rc0603-5557952.pdf?src-supplier=Mouser; ComponentLink2URL: https://datasheet.ciiva.com/11819/0900766b80f96399-11819357.pdf?src-supplier=RSComponents; ComponentLink2Description: https://datasheet.ciiva.com/11819/0900766b80f96399-11819357.pdf?src-supplier=RSComponents; ComponentLink3URL: https://datasheet.ciiva.com/2454/pyu-r-int-thick-7-2454246.pdf?src-supplier=Digi-Key; ComponentLink3Description: https://datasheet.ciiva.com/2454/pyu-r-int-thick-7-2454246.pdf?src-supplier=Digi-Key; ComponentLink4URL: https://datasheet.ciiva.com/2454/pyu-r-int-thick-7-2454247.pdf?src-supplier=Digi-Key; ComponentLink4Description: https://datasheet.ciiva.com/2454/pyu-r-int-thick-7-2454247.pdf?src-supplier=Digi-Key; ComponentLink5URL: https://datasheet.ciiva.com/2454/pyu-r-int-thick-7-2454248.pdf?src-supplier=Digi-Key; ComponentLink5Description: https://datasheet.ciiva.com/2454/pyu-r-int-thick-7-2454248.pdf?src-supplier=Digi-Key
TP17 = 0.1" Pad-A.4
U2 = CMP-04918-000601-1: IC REG BOOST 5V 3.6A 16HTSSOP; Max Output Current: 1A; Number of Outputs: 1; Synchronous Rectifier: Yes; Switching Frequency: 600kHz; Output Type: Fixed; Current Rating: 20mA; Max Input Voltage: 5.5V; Output Configuration: Positive; Quiescent Current: 20uA; Efficiency: 96%; Min Input Voltage: 1.8V; Package Quantity: 1; Max Operating Temperature: 85°C; Output Current: 1A; Min Operating Temperature: -40°C; Min Output Voltage: 5V; Topology: Boost; RoHS Compliant: Yes; Number of Pins: 16; Case/Package: HTSSOP; Series: -; Output Voltage: 5V; Mount: Surface Mount; Lead Free: Lead Free; Weight: 0.002212oz; Radiation Hardening: No; REACH SVHC: No SVHC; Nominal Output Voltage: 5V; Packaging: Tape and Reel; Width: 4.4mm; Operating Supply Voltage: 5.5V

## Sheet Buck converter.SchDoc: BUCK CONVERTER
size 431 x 279 mm; Date: 02/07/2022; ApprovedBy: RTZ,HYW; CheckedBy: RTZ,HYW; Author: RTZ,HYW; CompanyName: Upenn; DrawnBy: RTZ,HYW; Engineer: RTZ,HYW; Organization: Upenn ESE; Address1: Electrical Engineering; Address2: 200 South 33rd St; Address3: Philadelphia; Address4: PA, 19104; SheetNumber: 9; SheetTotal: 11; ENG_APP_DATE: 02/15/22; DSN_APP_DATE: 02/15/22; CHK_APP_DATE: 02/15/22; DOC_NO_ASSY_DWG: TBD; DOC_NO_FAB_DWG: TBD; PCB_DWG_NO: TBD; Project: SimonSayGame; DESIGN_ITEM: 1.0; DOC_NO_SCH_DWG: TBD; CAGE_CODE: TBD; SCH_SCALE: NA; Time: 13:18
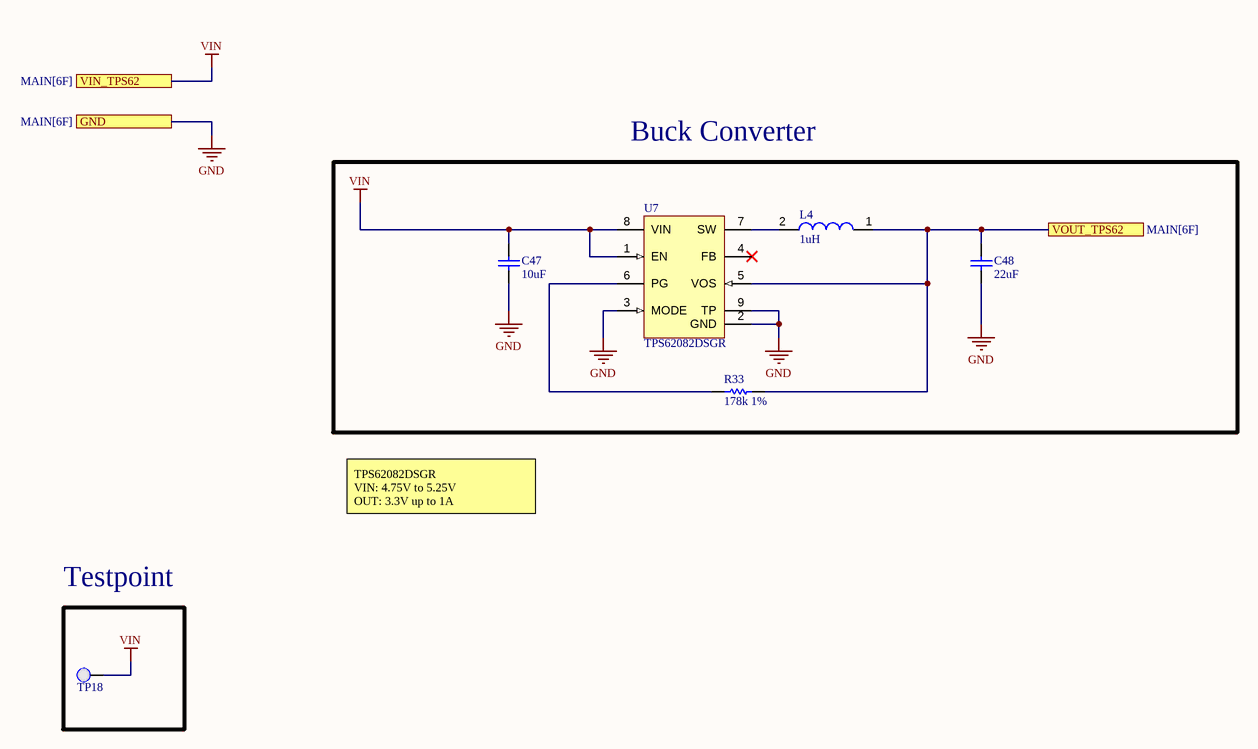
[diagram p8: Buck converter.SchDoc]

### Parts
C47  10uF  [CAPC2012X127N]
C48  22uF  [CAPC2012X127N]
L4  1uH  [744316100]
R33  178k 1%  [RESC1005X40X25NL05T05]
TP18  0.1" Pad  [PCBComponent]  (value not drawn)  (no BOM)
U7  TPS62082DSGR  [DSG0008A_V]

### Blocks framed on the sheet
Buck Converter: C47 C48 L4 R33 U7
Testpoint: TP18

### Ports
GND (see MAIN[6F]), VIN_TPS62 (see MAIN[6F]), VOUT_TPS62 (see MAIN[6F])

### Nets
GND: C47.1 C48.1 U7.2(GND) U7.3(MODE) U7.9(TP) ; port GND
VIN: C47.2 TP18.1(PAD) U7.1(EN) U7.8(VIN) ; port VIN_TPS62  [project net 5V]
VOUT_TPS62: C48.2 L4.1 R33.2 U7.5(VOS) ; port VOUT_TPS62
NetL4_2: L4.2 U7.7(SW)
NetR33_1: R33.1 U7.6(PG)

Not connected (* = marked no-connect by the designer): U7 4(FB)*

### Notes on the sheet
- TPS62082DSGR
  VIN: 4.75V to 5.25V
  OUT: 3.3V up to 1A
- DWG. NO.
- REV.
- SHT.
- THIS DOCUMENT AND THE DATA DISCLOSED HEREIN OR HEREWITH IS THE PROPERTY OF ALTIUM LIMITED AND MAY BE FREELY DISTRIBUTED IN WHOLE. NO RIGHTS ARE RESERVED OR EXPRESS OR IMPLIED WARANTEE GIVEN.
- REVISION
- DESCRIPTION
- DATE
- APPROVED
- ENG:
- APPROVALS
- PROJECT
- DSN:
- CHK:
- REFERENCE DOCUMENTS
- PROJECT REVISION:
- TITLE
- DOCUMENT REVISION:
- DESIGN ITEM:
- BOM:
- FAB DWG:
- PCB DWG:
- ASSY DWG:
- SCALE:
- SIZE
- B
- CAGE CODE
- FILE NAME
- DWG NO.
- SHEET
- OF
- REV

### Library data of the parts
C47 = CMP-06035-062410-1: as C44 on sheet Boost converter; Length: 0.039inch; Width: 0.02inch; Capacitance: 10uF; Max Operating Temperature: 85°C; Features: Soft Termination; Case Code (Metric): 1005; Tolerance: 20%; Min Operating Temperature: -55°C; Thickness: 0.028inch; Mount: Surface Mount; Packaging: Cut Tape; Case/Package: 0402; Case Code (Imperial): 0402; RoHS Compliant: Yes; Supplier 1: Digi-Key; Supplier Part Number 1: 490-13211-2-ND; RoHS: Yes; Category: Ceramic Capacitors; Stock 1: 1752680; Pricing 1: 10000=0.03490, 20000=0.03307 (USD); ComponentLink1URL: http://psearch.en.murata.com/capacitor/product/GRJ155R60J106ME11%23.pdf?src-supplier=Digi-Key; ComponentLink1Description: http://psearch.en.murata.com/capacitor/product/GRJ155R60J106ME11%23.pdf?src-supplier=Digi-Key; Supplier 2: Digi-Key; Supplier Part Number 2: 311-1338-2-ND; Stock 2: 27298742; Pricing 2: 10000=0.00554, 20000=0.00528 (USD); Number of Pins: 2; Dielectric: X7R; Voltage Rating (DC): 16V; Package Quantity: 1; Termination: SMD/SMT; Resistor Type: Ceramic; Voltage: 16V; Series: CC; Height: 0.5mm; Depth: 0.5mm; Radiation Hardening: No; REACH SVHC: No SVHC; Lead Free: Lead Free; Halogen Free: Halogen Free; ComponentLink2URL: https://datasheet.ciiva.com/11788/0900766b80ce67ed-11788364.pdf?src-supplier=RSComponents; ComponentLink2Description: https://datasheet.ciiva.com/11788/0900766b80ce67ed-11788364.pdf?src-supplier=RSComponents; ComponentLink3URL: https://datasheet.ciiva.com/7978/1489800-7978111.pdf?src-supplier=Element14; ComponentLink3Description: https://datasheet.ciiva.com/7978/1489800-7978111.pdf?src-supplier=Element14; ComponentLink4URL: https://datasheet.ciiva.com/28450/1489800-28450335.pdf?src-supplier=Element14; ComponentLink4Description: https://datasheet.ciiva.com/28450/1489800-28450335.pdf?src-supplier=Element14; ComponentLink5URL: https://datasheet.ciiva.com/161/mlccorderingcode-161545.pdf?src-supplier=Digi-Key; ComponentLink5Description: https://datasheet.ciiva.com/161/mlccorderingcode-161545.pdf?src-supplier=Digi-Key; ComponentLink6URL: https://datasheet.ciiva.com/161/mlccorderingcode-161544.pdf?src-supplier=Digi-Key; ComponentLink6Description: https://datasheet.ciiva.com/161/mlccorderingcode-161544.pdf?src-supplier=Digi-Key; ComponentLink7URL: https://datasheet.ciiva.com/161/mlccorderingcode-161546.pdf?src-supplier=Digi-Key; ComponentLink7Description: https://datasheet.ciiva.com/161/mlccorderingcode-161546.pdf?src-supplier=Digi-Key; ComponentLink8URL: https://datasheet.ciiva.com/13395/upy-gphc-x7r-6-3v-to-50v-8-13395676.pdf?src-supplier=Mouser; ComponentLink8Description: https://datasheet.ciiva.com/13395/upy-gphc-x7r-6-3v-to-50v-8-13395676.pdf?src-supplier=Mouser; ComponentLink9URL: https://datasheet.ciiva.com/11587/upy-gphc-x7r-6-3v-to-50v-8-11587305.pdf?src-supplier=Avnet; ComponentLink9Description: https://datasheet.ciiva.com/11587/upy-gphc-x7r-6-3v-to-50v-8-11587305.pdf?src-supplier=Avnet; ComponentLink10URL: https://datasheet.ciiva.com/8033/1734573-8033663.pdf?src-supplier=Element14; ComponentLink10Description: https://datasheet.ciiva.com/8033/1734573-8033663.pdf?src-supplier=Element14; ComponentLink11URL: https://datasheet.ciiva.com/8033/1734573-8033661.pdf?src-supplier=Element14; ComponentLink11Description: https://datasheet.ciiva.com/8033/1734573-8033661.pdf?src-supplier=Element14; ComponentLink12URL: https://datasheet.ciiva.com/16625/upy-gphc-x7r-6-3v-to-50v-8-16625511.pdf?src-supplier=Avnet+Europe; ComponentLink12Description: https://datasheet.ciiva.com/16625/upy-gphc-x7r-6-3v-to-50v-8-16625511.pdf?src-supplier=Avnet+Europe; Supplier 3: Digi-Key; Supplier Part Number 3: 311-3508-1-ND; Stock 3: 2481; Pricing 3: 1=0.64000, 10=0.45400, 50=0.34360, 100=0.29920, 500=0.22164, 1000=0.18840 (USD); ComponentLink13URL: http://www.yageo.com/documents/recent/UPY-GPHC_X7R_6.3V-to-50V_18.pdf?src-supplier=Digi-Key; ComponentLink13Description: http://www.yageo.com/documents/recent/UPY-GPHC_X7R_6.3V-to-50V_18.pdf?src-supplier=Digi-Key; ComponentLink14URL: https://datasheet.octopart.com/CC0805MKX7R7BB106-Yageo-datasheet-10883670.pdf; ComponentLink14Description: https://datasheet.octopart.com/CC0805MKX7R7BB106-Yageo-datasheet-10883670.pdf; ComponentLink15URL: https://datasheet.octopart.com/Surface-Mount-Ceramic-Multilayer-Capacitors%3B-General-Purpose-%26-High-Capacitance-Class-2%2C-X7R-Yageo-datasheet-family-114.pdf; ComponentLink15Description: https://datasheet.octopart.com/Surface-Mount-Ceramic-Multilayer-Capacitors%3B-General-Purpose-%26-High-Capacitance-Class-2%2C-X7R-Yageo-datasheet-family-114.pdf; ComponentLink16URL: https://datasheet.octopart.com/CC0805MKX7R7BB106-Yageo-datasheet-147453679.pdf?src-supplier=Future+Electronics; ComponentLink16Description: https://datasheet.octopart.com/CC0805MKX7R7BB106-Yageo-datasheet-147453679.pdf?src-supplier=Future+Electronics
C48 = GRM188R60J226MEA0D: Buck Cout, Multilayer Ceramic Capacitors 0805 25V X5R 226 20% 7'REEL PLASTIC; Manufacturer: Murata; Voltage Rating: 6.3V; Supplier 1: Digi-Key; Supplier Part Number 1: 490-7611-2-ND; Manufacturer Part Number: GRM188R60J226MEA0D; RoHS: Yes; Category: Ceramic Capacitors; Stock 1: 1396125; Pricing 1: 4000=0.03800, 8000=0.03610 (USD); Mount: Surface Mount; Case/Package: 0603; Case Code (Metric): 1608; Case Code (Imperial): 0603; Weight: 0.000222oz; Min Operating Temperature: -55°C; Max Operating Temperature: 85°C; Capacitance: 22uF; Tolerance: 20%; Packaging: Tape and Reel; Package Quantity: 4000; Dielectric: X5R; Termination: SMD/SMT; Voltage Rating (DC): 6.3V; Length: 1.6mm; Width: 0.8mm; Height: 0.8mm; Thickness: 0.039inch; Depth: 0.8mm; REACH SVHC: No SVHC; Lead Free: Lead Free; RoHS Compliant: Yes; ComponentLink1URL: https://datasheet.ciiva.com/29540/partnumbering-e-01-29540441.pdf?src-supplier=Digi-Key; ComponentLink1Description: https://datasheet.ciiva.com/29540/partnumbering-e-01-29540441.pdf?src-supplier=Digi-Key; ComponentLink2URL: https://datasheet.ciiva.com/29540/partnumbering-e-01-29540442.pdf?src-supplier=Digi-Key; ComponentLink2Description: https://datasheet.ciiva.com/29540/partnumbering-e-01-29540442.pdf?src-supplier=Digi-Key; ComponentLink3URL: https://datasheet.ciiva.com/29540/partnumbering-e-01-29540443.pdf?src-supplier=Digi-Key; ComponentLink3Description: https://datasheet.ciiva.com/29540/partnumbering-e-01-29540443.pdf?src-supplier=Digi-Key; Supplier 2: Digi-Key; Supplier Part Number 2: 311-1903-2-ND; Stock 2: 65672; Pricing 2: 3000=0.12413, 6000=0.11638 (USD); Halogen Free: Halogen Free; ComponentLink4URL: http://www.mouser.com/ds/2/447/Yageo_UPY-GP_NP0_16V-to-50V_9-358835.pdf?src-supplier=Mouser; ComponentLink4Description: http://www.mouser.com/ds/2/447/Yageo_UPY-GP_NP0_16V-to-50V_9-358835.pdf?src-supplier=Mouser; ComponentLink5URL: http://www.yageo.com/documents/recent/UPY-GPHC_X5R_4V-to-50V_25.pdf?src-supplier=Digi-Key; ComponentLink5Description: http://www.yageo.com/documents/recent/UPY-GPHC_X5R_4V-to-50V_25.pdf?src-supplier=Digi-Key
L4 = 744316100: Buck L1-Inductor Power Shielded Wirewound 1uH/0.65uH 20% 100KHz 11.5A 0.00475Ohm DCR Automotive T/R; Manufacturer: Wurth Electronics; DC Resistance (DCR): 4.75mR; Self Resonant Frequency: 158MHz; Supplier 1: Digi-Key; Supplier Part Number 1: 732-6176-1-ND; Manufacturer Part Number: 744316100; RoHS: Yes; Category: Fixed Inductors; Stock 1: 1274; Pricing 1: 1=2.64000, 50=2.44400, 100=2.22200, 250=2.01900, 500=1.83600 (USD); Mount: Surface Mount; Case/Package: SMD/SMT; Number of Pins: 2; Min Operating Temperature: -40°C; Max Operating Temperature: 150°C; Packaging: Cut Tape; Resistor Type: Wirewound; Inductance: 1uH; Current Rating: 11.5A; Saturation Current: 11.5A; Shielding: Shielded; Test Frequency: 100kHz; RMS Current (Irms): 11.5A; Tolerance: 20%; Inductance Tolerance: 20%; Length: 0.217inch; Width: 0.209inch; Height - Seated (Max): 0.169inch; REACH SVHC: Unknown; RoHS Compliant: Yes; ComponentLink1URL: http://www.farnell.com/datasheets/1880919.pdf?src-supplier=Farnell; ComponentLink1Description: http://www.farnell.com/datasheets/1880919.pdf?src-supplier=Farnell; ComponentLink2URL: https://katalog.we-online.de/pbs/datasheet/744316100.pdf?src-supplier=Digi-Key; ComponentLink2Description: https://katalog.we-online.de/pbs/datasheet/744316100.pdf?src-supplier=Digi-Key; ComponentLink3URL: http://www.farnell.com/datasheets/1880919.pdf?src-supplier=Element14; ComponentLink3Description: http://www.farnell.com/datasheets/1880919.pdf?src-supplier=Element14
R33 = CMP-2002-00733-1: Buck Rpg, Res Thick Film 0402 178K Ohm 1% 0.063W ±100ppm/°C Molded SMD Paper T/R; Part Number: ERJ-2RKF1783X; Manufacturer: Panasonic; Manufacturer Part Number: RMCF0402FT178K; Resistance: 178kR; Power Rating: 63mW; Supplier 1: Digi-Key; Supplier Part Number 1: RMCF0402FT178KCT-ND; RoHS: Yes; Category: Chip SMD Resistors; Stock 1: 6763; Pricing 1: 1=0.10000, 10=0.01500, 100=0.00610, 1000=0.00274, 2500=0.00238, 5000=0.00197 (USD); Mount: Surface Mount; Case/Package: 0402; Case Code (Metric): 1005; Case Code (Imperial): 0402; Contact Plating: Tin,Matte; Size Code: 0402; Min Operating Temperature: -55°C; Max Operating Temperature: 155°C; Tolerance: 1%; Packaging: Tape and Reel; Resistor Type: Thick Film; Number of Terminations: 2; Max Power Dissipation: 63mW; Temperature Coefficient: 100ppm/°C; Features: Automotive AEC-Q200; Series: RMCF; Length: 0.039inch; Width: 0.02inch; Height: 0.016inch; Radiation Hardening: No; Lead Free: Lead Free; RoHS Compliant: Yes; ComponentLink1URL: https://www.seielect.com/Catalog/SEI-RMCF_RMCP.pdf?src-supplier=Digi-Key; ComponentLink1Description: https://www.seielect.com/Catalog/SEI-RMCF_RMCP.pdf?src-supplier=Digi-Key; ComponentLink2URL: https://www.seielect.com/catalog/SEI-Packaging.pdf?src-supplier=Digi-Key; ComponentLink2Description: https://www.seielect.com/catalog/SEI-Packaging.pdf?src-supplier=Digi-Key; ComponentLink3URL: https://www.seielect.com/catalog/SEI-RMCF_RMCP.pdf?src-supplier=Avnet; ComponentLink3Description: https://www.seielect.com/catalog/SEI-RMCF_RMCP.pdf?src-supplier=Avnet; ComponentLink4URL: http://seielect.com/Catalog/SEI-RMC.pdf?src-supplier=Future+Electronics; ComponentLink4Description: http://seielect.com/Catalog/SEI-RMC.pdf?src-supplier=Future+Electronics
TP18 = 0.1" Pad-A.4
U7 = CMP-0323-00344-3: Buck Step Down Regulator with 2.3 to 6 V Input and 3.3 V Output, -40 to 85 degC, 8-Pin WSON (DSG), Green (RoHS & no Sb/Br); Manufacturer: Texas Instruments; Switch Current Limit(Typ)(A): 2.4; Vin(Min)(V): 2.3; Iq(Typ)(mA): 0.006; Regulated Outputs(#): 1; Vout(Max)(V): 3.3; Duty Cycle(Max)(%): 100; Iout(Max)(A): 1.2; SubFamily: Step-Down Regulator; Rating: Catalog; Vin(Max)(V): 6; ComponentLink1Description: Datasheet; ComponentLink3Description: URL Link1; ComponentLink2URL: http://www.ti.com/litv/pdf/mpds308a; DatasheetVersion: SLVSAE8B; PackageVersion: revB, Oct-2010; Eco-Plan: Green (RoHS & no Sb/Br); ComponentLink2Description: Package Specification; PackageReference: DSG0008A; Code_JEDEC: MO-229; Topology: Buck; PartNumber: TPS62082DSGR; PackageDescription: 8-Pin Plastic Small Outline No-Lead, 2 x 2 x 0.8 mm Body, 0.5 mm Pitch, Exposed Pad; ComponentLink1URL: http://www.ti.com/general/docs/lit/getliterature.tsp?genericPartNumber=TPS62082&fileType=pdf; ComponentLink3URL: Samples URL:http://www.ti.com/product/tps62082#samples; Vout(Min)(V): 3.3; Mounting Technology: Surface Mount

## Sheet Gesture_Sensor.SchDoc: GESTURE SENSOR
size 431 x 279 mm; Date: 02/07/2022; ApprovedBy: RTZ,HYW; CheckedBy: RTZ,HYW; Author: RTZ,HYW; CompanyName: Upenn; DrawnBy: RTZ,HYW; Engineer: RTZ,HYW; Organization: Upenn ESE; Address1: Electrical Engineering; Address2: 200 South 33rd St; Address3: Philadelphia; Address4: PA, 19104; SheetNumber: 10; SheetTotal: 11; ENG_APP_DATE: 02/15/22; DSN_APP_DATE: 02/15/22; CHK_APP_DATE: 02/15/22; DOC_NO_ASSY_DWG: TBD; DOC_NO_FAB_DWG: TBD; PCB_DWG_NO: TBD; Project: SimonSayGame; DESIGN_ITEM: 1.0; DOC_NO_SCH_DWG: TBD; SCH_SCALE: NA; CAGE_CODE: TBD; Time: 13:18
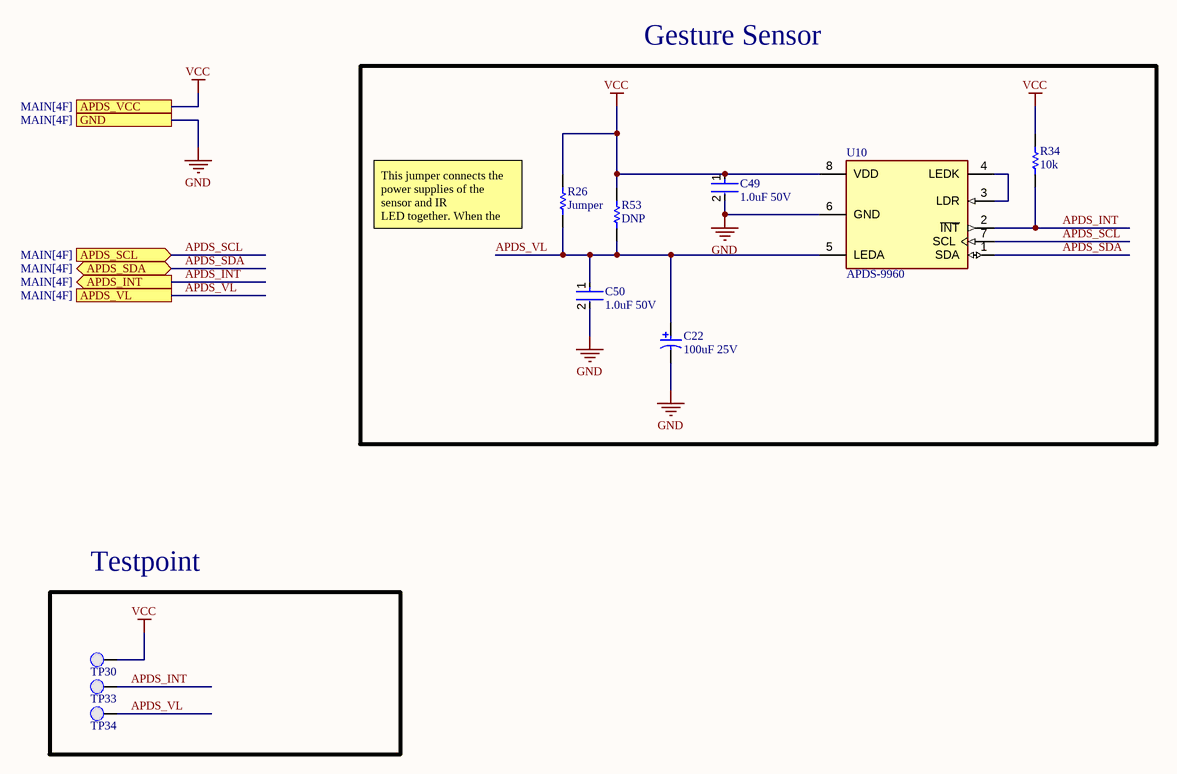
[diagram p9: Gesture_Sensor.SchDoc]

### Parts
C22  100uF 25V  [EDK107M025A9HAA]
C49  1.0uF 50V  [FP-0603-L_1_6_0_1-W_0_8_0-IPC_A]
C50  1.0uF 50V  [FP-0603-L_1_6_0_1-W_0_8_0-IPC_A]
R26  Jumper  [RESC0603(1608)_N]
R34  10k  [RESC1005X40X25ML05T05]
R53  DNP  [DNP]  (no BOM)
TP30  0.1" Pad  [PCBComponent]  (value not drawn)  (no BOM)
TP33  0.1" Pad  [PCBComponent]  (value not drawn)  (no BOM)
TP34  0.1" Pad  [PCBComponent]  (value not drawn)  (no BOM)
U10  APDS-9960  [FP-APDS-9960-MFG]

### Blocks framed on the sheet
Gesture Sensor: C22 C49 C50 R26 R34 R53 U10
Testpoint: TP30 TP33 TP34

### Ports
APDS_INT (out, see MAIN[4F]), APDS_SCL (in, see MAIN[4F]), APDS_SDA (bidir, see MAIN[4F]), APDS_VCC (see MAIN[4F]), APDS_VL (see MAIN[4F]), GND (see MAIN[4F])

### Nets
GND: C22.2 C49.2 C50.2 U10.6(GND) ; port GND
VCC: C49.1 R26.2 R34.2 R53.2 TP30.1(PAD) U10.8(VDD) ; port APDS_VCC  [project net 3V3]
APDS_INT: R34.1 TP33.1(PAD) U10.2(~{INT}) ; port APDS_INT
APDS_SCL: U10.7(SCL) ; port APDS_SCL  [project net SCL]
APDS_SDA: U10.1(SDA) ; port APDS_SDA  [project net SDA]
APDS_VL: C22.1 C50.1 R26.1 R53.1 TP34.1(PAD) U10.5(LEDA) ; port APDS_VL
NetU10_3: U10.3(LDR) U10.4(LEDK)

### Notes on the sheet
- (near R26) This jumper connects the power supplies of the sensor and IR
  LED together. When the jumper is
  closed, VCC
  pin will power both the sensor and the IR LED. If the jumper is open,
  you need to provide power to both the VCC (2.4 - 3.6V) and VL (3.0 -
  4.5V) pins separately. This jumper is closed by default.
- DWG. NO.
- REV.
- SHT.
- THIS DOCUMENT AND THE DATA DISCLOSED HEREIN OR HEREWITH IS THE PROPERTY OF ALTIUM LIMITED AND MAY BE FREELY DISTRIBUTED IN WHOLE. NO RIGHTS ARE RESERVED OR EXPRESS OR IMPLIED WARANTEE GIVEN.
- REVISION
- DESCRIPTION
- DATE
- APPROVED
- ENG:
- APPROVALS
- PROJECT
- DSN:
- CHK:
- REFERENCE DOCUMENTS
- PROJECT REVISION:
- TITLE
- DOCUMENT REVISION:
- DESIGN ITEM:
- BOM:
- FAB DWG:
- PCB DWG:
- ASSY DWG:
- SCALE:
- SIZE
- B
- CAGE CODE
- FILE NAME
- DWG NO.
- SHEET
- OF
- REV

### Library data of the parts
C22 = CMP-0687-00063-1: Aluminum Electrolytic Capacitor, UD Series, Low Impedance, 100 uF, 25 V, + / - 20%, -40 to 85 degC, Chip Type, 6.3 x 7.7 mm D x L; PartNumber: UUD1E101MCL1GS; Manufacturer: Nichicon; Rated Ripple Current (at 100kHz): 280 mA; Endurance Time: 2000 h; Packing: Dia382mm Reel; Tolerance Rated Capacitance: -20 to 20%; Impedance: 0.34 Ohm; PackageReference: CAPAE-D6.3H7.7; RoHS: TRUE; PackageDescription: 2-Pin Surface Mount Device, Diameter 6.3 mm, Height 7.7 mm, Pitch 5.4 mm; Mounting Technology: Surface Mount; Rated Voltage: 25 V; ComponentLink3Description: Package Specification; Diameter: 6.3 mm; DatasheetVersion: 08/2012; ComponentLink3URL: http://products.nichicon.co.jp/en/pdf/XJA043/e-ud.pdf; Length: 7.7 mm; ComponentLink2Description: Datasheet; ComponentLink2URL: http://products.nichicon.co.jp/en/pdf/XJA043/e-ud.pdf; Rated Capacitance: 100 uF; ComponentLink1Description: Manufacturer URL; ComponentLink1URL: http://www.nichicon.co.jp/
C49 C50 = CMP-2000-05447-3: None; Tolerance: 10%; Capacitance: 1uF; Dielectric: X5R; Height: 0.8mm; Depth: 0.8mm; Number of Pins: 2; Length: 1.6mm; Thickness: 0.035inch; Voltage Rating: 50V; Contact Plating: Nickel; Radiation Hardening: No; Package Quantity: 1; Case/Package: 0603; Halogen Free: Halogen Free; RoHS Compliant: Yes; Termination: SMD/SMT; Max Operating Temperature: 85°C; Min Operating Temperature: -55°C; Case Code (Metric): 1608; Construction: Flat; Voltage Rating (DC): 50V; Packaging: Tape and Reel; Series: M; Case Code (Imperial): 0603; Width: 0.031inch; Mount: Surface Mount
R26 = CMP-1012-00001-1: as R43 on sheet Joystick; Technology: SMT; Tolerance: None
R34 = CMP-2000-07588-1: Chip Resistor, 10 KOhm, +/- 1%, 0.1 W, -55 to 155 degC, 0402 (1005 Metric), RoHS, Tape and Reel; Manufacturer: Panasonic; Power Rating: 100mW; Voltage Rating: 50V; Resistance: 10KOhm; Case\/Package: 0402; Temperature Coefficient: 100ppm\/degreesC; RoHSCompliant: True; Lead Free: LeadFree; Package Quantity: 1; Contact Plating: Tin; Length: 1mm; Radiation Hardening: No; REACH SVHC: NoSVHC; Max Operating Temperature: 155degC; Depth: 0.5mm; Case Code (Imperial): 0402; Military Standard: Not; Package Description: 2-Pin Surface Mount Device, Body 1 x 0.5 mm; Termination: SMD/SMT; Case Code (Metric): 1005; Height: 0.35mm; Packaging: TapeandReel; Voltage Rating (DC): 50V; Package Reference: 402; Number of Pins: 2; Tolerance: 1%; Mounting Technology: SurfaceMount; Width: 0.02inch; Mount: SurfaceMount; Datasheet URL: https://industrial.panasonic.com/cdbs/www-data/pdf/RDA0000/AOA0000C304.pdf; Composition: ThickFilm; Datasheet Version: 02/2017; Manufacturer URL: http://www.panasonic.com/; Max Power Dissipation: 100mW; Number of Terminations: 2; Min Operating Temperature: -55degC
R53 = DNP: as R45 on sheet Joystick; RoHS: Yes; Case/Package: 0402; Number of Pins: 2; Contact Plating: Tin; Case Code (Metric): 1005; Case Code (Imperial): 0402; Min Operating Temperature: -55°C; Max Operating Temperature: 155°C; Resistor Type: Thick Film; Package Quantity: 10; Number of Terminations: 2; Termination: SMD/SMT; Max Power Dissipation: 63mW; Features: Automotive AEC-Q200; Series: CRCW; Voltage Rating (DC): 50V; Construction: Rectangular; Technology: THICK FILM; Length: 1mm; Width: 0.02inch; Height: 0.35mm; Depth: 0.5mm; Radiation Hardening: No; RoHS Compliant: Yes; Lead Free: Lead Free; REACH SVHC: Unknown; Military Standard: Not
TP30 TP33 TP34 = 0.1" Pad-A.4
U10 = CMP-2000-05060-2: SENSOR OPT 560NM AMBIENT MODULE; Max Supply Voltage (DC): 3.6V; Min Supply Voltage (DC): 2.4V; Sensing Distance: 100mm; Output Type: Digital; Min Operating Temperature: -30°C; Wavelength: 560nm; REACH SVHC: No SVHC; Packaging: Tape and Reel; Max Operating Temperature: 85°C; Mount: Surface Mount; Case/Package: SMD/SMT; Number of Pins: 8